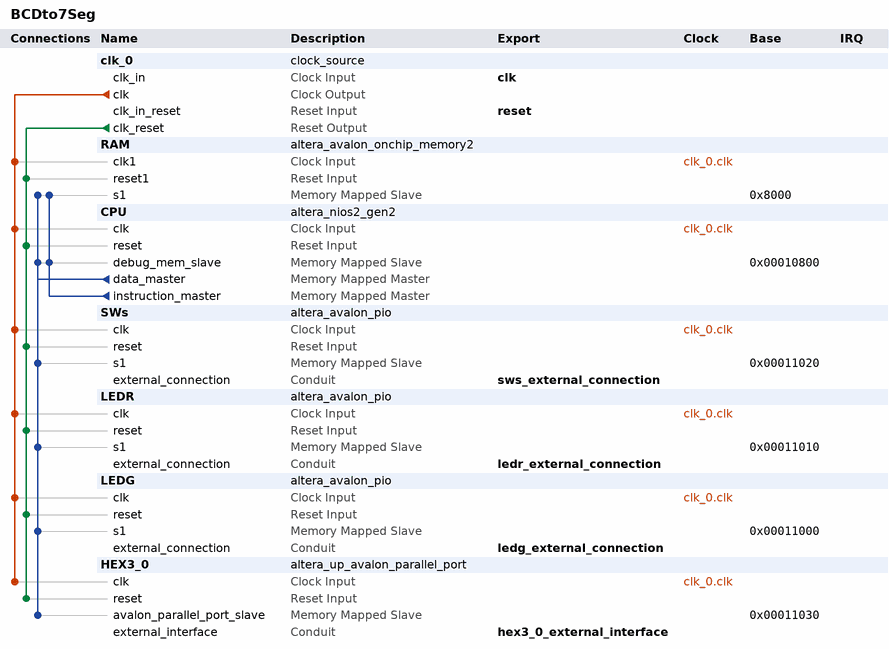
[diagram p0: system contents]
# Platform Designer (Qsys) system BCDto7Seg, Cyclone IV E EP4CE115F29C7
# Parameters at their usual value, and those the tool derives, are not listed.
package require -exact qsys 18.1
create_system BCDto7Seg
set_project_property DEVICE_FAMILY {Cyclone IV E}
set_project_property DEVICE EP4CE115F29C7

add_instance clk_0 clock_source 18.1
set_instance_parameter_value clk_0 clockFrequency 50000000

add_instance RAM altera_avalon_onchip_memory2 18.1
set_instance_parameter_value RAM dataWidth 32
set_instance_parameter_value RAM dualPort false
set_instance_parameter_value RAM initMemContent true
set_instance_parameter_value RAM initializationFileName onchip_mem.hex
set_instance_parameter_value RAM memorySize 32768

add_instance CPU altera_nios2_gen2 18.1
set_instance_parameter_value CPU dcache_size 2048
set_instance_parameter_value CPU exceptionSlave RAM.s1
set_instance_parameter_value CPU icache_size 4096
set_instance_parameter_value CPU impl Tiny
set_instance_parameter_value CPU resetSlave RAM.s1

add_instance SWs altera_avalon_pio 18.1
set_instance_parameter_value SWs direction Input
set_instance_parameter_value SWs width 4

add_instance LEDR altera_avalon_pio 18.1
set_instance_parameter_value LEDR direction Output
set_instance_parameter_value LEDR width 4

add_instance LEDG altera_avalon_pio 18.1
set_instance_parameter_value LEDG direction Output
set_instance_parameter_value LEDG width 4

add_instance HEX3_0 altera_up_avalon_parallel_port 18.0
set_instance_parameter_value HEX3_0 board DE2-115
set_instance_parameter_value HEX3_0 capture false
set_instance_parameter_value HEX3_0 edge Rising
set_instance_parameter_value HEX3_0 irq false
set_instance_parameter_value HEX3_0 preset {Seven Segment Displays}

# connections
add_connection clk_0.clk CPU.clk clock
add_connection clk_0.clk HEX3_0.clk clock
add_connection clk_0.clk LEDG.clk clock
add_connection clk_0.clk LEDR.clk clock
add_connection clk_0.clk RAM.clk1 clock
add_connection clk_0.clk SWs.clk clock
add_connection clk_0.clk_reset CPU.reset reset
add_connection clk_0.clk_reset HEX3_0.reset reset
add_connection clk_0.clk_reset LEDG.reset reset
add_connection clk_0.clk_reset LEDR.reset reset
add_connection clk_0.clk_reset RAM.reset1 reset
add_connection clk_0.clk_reset SWs.reset reset
add_connection CPU.data_master CPU.debug_mem_slave avalon
set_connection_parameter_value CPU.data_master/CPU.debug_mem_slave baseAddress 0x00010800
add_connection CPU.data_master HEX3_0.avalon_parallel_port_slave avalon
set_connection_parameter_value CPU.data_master/HEX3_0.avalon_parallel_port_slave baseAddress 0x00011030
add_connection CPU.data_master LEDG.s1 avalon
set_connection_parameter_value CPU.data_master/LEDG.s1 baseAddress 0x00011000
add_connection CPU.data_master LEDR.s1 avalon
set_connection_parameter_value CPU.data_master/LEDR.s1 baseAddress 0x00011010
add_connection CPU.data_master RAM.s1 avalon
set_connection_parameter_value CPU.data_master/RAM.s1 baseAddress 0x8000
add_connection CPU.data_master SWs.s1 avalon
set_connection_parameter_value CPU.data_master/SWs.s1 baseAddress 0x00011020
add_connection CPU.instruction_master CPU.debug_mem_slave avalon
set_connection_parameter_value CPU.instruction_master/CPU.debug_mem_slave baseAddress 0x00010800
add_connection CPU.instruction_master RAM.s1 avalon
set_connection_parameter_value CPU.instruction_master/RAM.s1 baseAddress 0x8000

# exported interfaces
add_interface clk clock sink
set_interface_property clk EXPORT_OF clk_0.clk_in
add_interface hex3_0_external_interface conduit end
set_interface_property hex3_0_external_interface EXPORT_OF HEX3_0.external_interface
add_interface ledg_external_connection conduit end
set_interface_property ledg_external_connection EXPORT_OF LEDG.external_connection
add_interface ledr_external_connection conduit end
set_interface_property ledr_external_connection EXPORT_OF LEDR.external_connection
add_interface reset reset sink
set_interface_property reset EXPORT_OF clk_0.clk_in_reset
add_interface sws_external_connection conduit end
set_interface_property sws_external_connection EXPORT_OF SWs.external_connection

set_interconnect_requirement {$system} qsys_mm.clockCrossingAdapter HANDSHAKE
set_interconnect_requirement {$system} qsys_mm.enableEccProtection FALSE
set_interconnect_requirement {$system} qsys_mm.insertDefaultSlave FALSE
set_interconnect_requirement {$system} qsys_mm.maxAdditionalLatency 1

save_system BCDto7Seg.qsys
